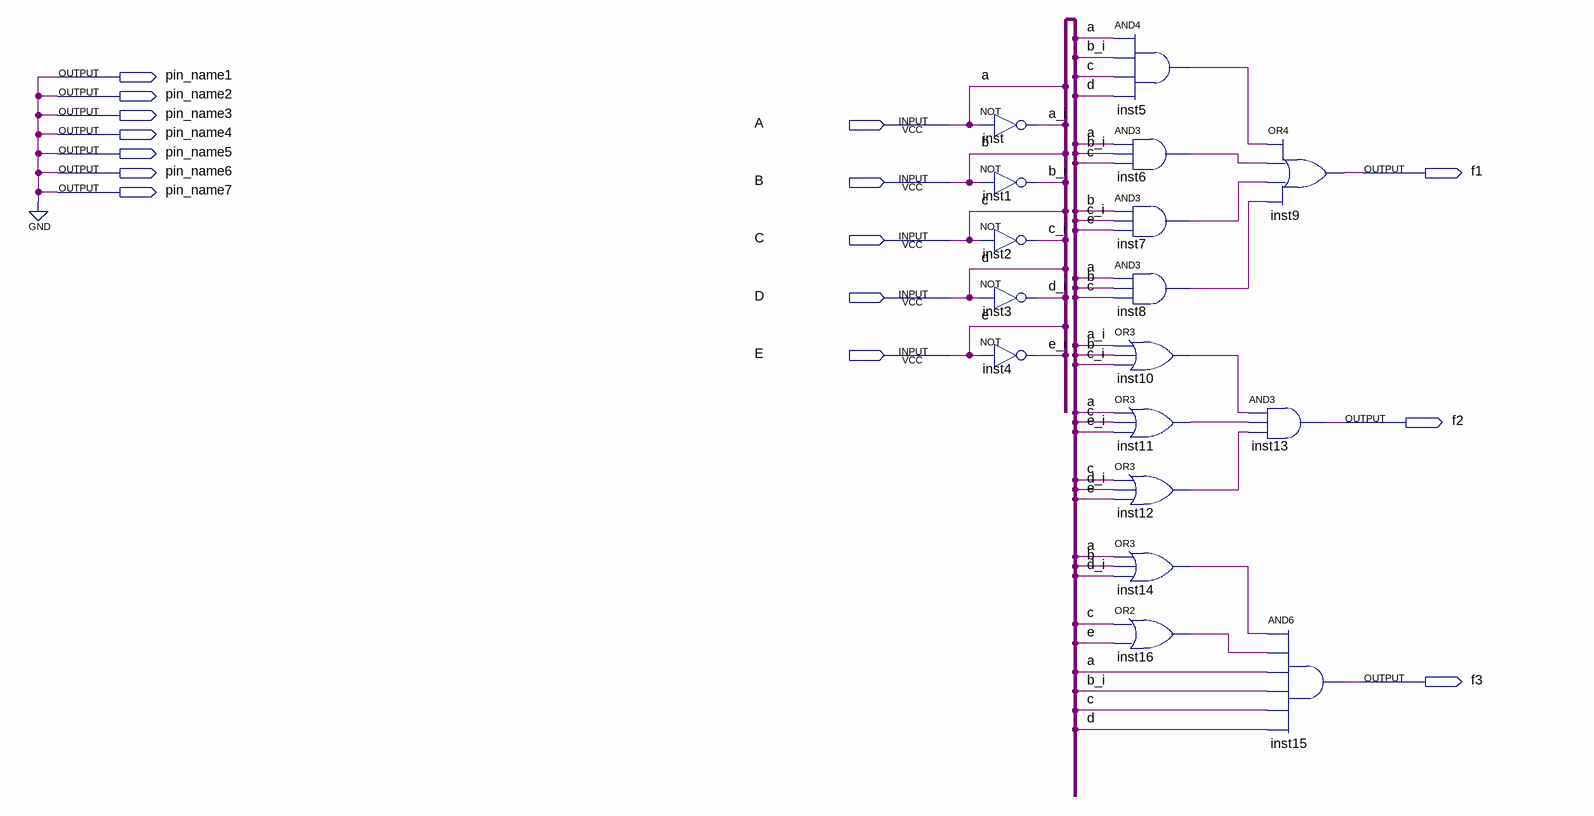
[diagram p0: schematic sheet]
// Quartus schematic lab_8_1_.bdf as structural Verilog: 17 symbols, 15 pins
module lab_8_1_ (
  input  A,
  input  B,
  input  C,
  input  D,
  input  E,
  output pin_name1,
  output pin_name2,
  output pin_name3,
  output pin_name4,
  output pin_name5,
  output pin_name6,
  output f1,
  output pin_name7,
  output f2,
  output f3
);

  wire a_i, b_i, c_i, d_i, e_i, inst5_out, inst6_out, inst7_out, inst8_out, inst10_out, inst11_out,
       inst12_out, inst14_out, inst16_out;

  not inst (a_i, A);
  not inst1 (b_i, B);
  not inst2 (c_i, C);
  not inst3 (d_i, D);
  not inst4 (e_i, E);
  and inst5 (inst5_out, A, b_i, C, D);
  and inst6 (inst6_out, A, b_i, C);
  and inst7 (inst7_out, B, c_i, E);
  and inst8 (inst8_out, A, B, C);
  or inst10 (inst10_out, a_i, B, c_i);
  or inst11 (inst11_out, A, C, e_i);
  or inst12 (inst12_out, C, d_i, E);
  or inst14 (inst14_out, A, B, d_i);
  or inst16 (inst16_out, C, E);
  or inst9 (f1, inst5_out, inst6_out, inst7_out, inst8_out);
  and inst13 (f2, inst10_out, inst11_out, inst12_out);
  and inst15 (f3, inst14_out, inst16_out, A, b_i, C, D);

  assign pin_name1 = 1'b0;
  assign pin_name2 = 1'b0;
  assign pin_name3 = 1'b0;
  assign pin_name4 = 1'b0;
  assign pin_name5 = 1'b0;
  assign pin_name6 = 1'b0;
  assign pin_name7 = 1'b0;
endmodule
